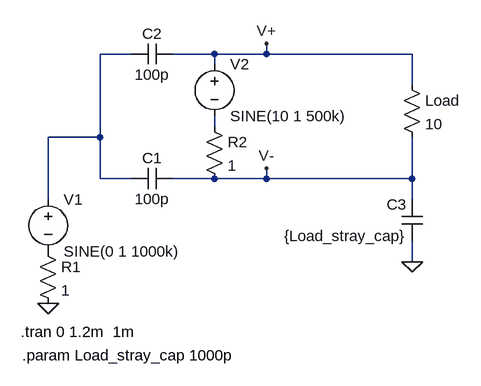
[diagram p0: schematic Common_Mode_Choke.asc]
Common_Mode_Choke.asc, the LTspice schematic file:
Version 4
SHEET 1 880 680
WIRE 112 32 64 32
WIRE 240 32 176 32
WIRE 320 32 320 16
WIRE 320 32 240 32
WIRE 544 32 320 32
WIRE 240 48 240 32
WIRE 544 80 544 32
WIRE 240 144 240 128
WIRE 64 160 64 32
WIRE 64 160 -16 160
WIRE 64 224 64 160
WIRE 112 224 64 224
WIRE 240 224 176 224
WIRE 320 224 320 208
WIRE 320 224 240 224
WIRE 544 224 544 160
WIRE 544 224 320 224
WIRE -16 256 -16 160
WIRE 544 256 544 224
WIRE 544 352 544 320
FLAG -16 416 0
FLAG 544 352 0
FLAG 320 16 V+
FLAG 320 208 V-
SYMBOL voltage -16 240 R0
WINDOW 123 0 0 Left 0
WINDOW 39 0 0 Left 0
SYMATTR InstName V1
SYMATTR Value SINE(0 1 1000k)
SYMBOL res -32 320 R0
SYMATTR InstName R1
SYMATTR Value 1
SYMBOL cap 176 208 R90
WINDOW 0 0 32 VBottom 2
WINDOW 3 32 32 VTop 2
SYMATTR InstName C1
SYMATTR Value 100p
SYMBOL cap 176 16 R90
WINDOW 0 0 32 VBottom 2
WINDOW 3 32 32 VTop 2
SYMATTR InstName C2
SYMATTR Value 100p
SYMBOL voltage 240 32 R0
WINDOW 123 0 0 Left 0
WINDOW 39 0 0 Left 0
SYMATTR InstName V2
SYMATTR Value SINE(10 1 500k)
SYMBOL res 224 128 R0
SYMATTR InstName R2
SYMATTR Value 1
SYMBOL res 528 64 R0
SYMATTR InstName Load
SYMATTR Value 10
SYMBOL cap 560 320 R180
WINDOW 0 24 56 Left 2
WINDOW 3 24 8 Left 2
SYMATTR InstName C3
SYMATTR Value {Load_stray_cap}
TEXT -56 496 Left 2 !.param Load_stray_cap 1000p
TEXT -58 460 Left 2 !.tran 0 1.2m  1m

The netlist it stands for:
* Common_Mode_Choke.asc
V1 N001 P001 SINE(0 1 1000k)
R1 P001 0 1
C1 V- N001 100p
C2 V+ N001 100p
V2 V+ N002 SINE(10 1 500k)
R2 N002 V- 1
R§Load V+ V- 10
C3 0 V- {Load_stray_cap}
.param Load_stray_cap 1000p
.tran 0 1.2m  1m
.backanno
.end